# EAGLE design rc-winch-controller (EAGLE 5.12)
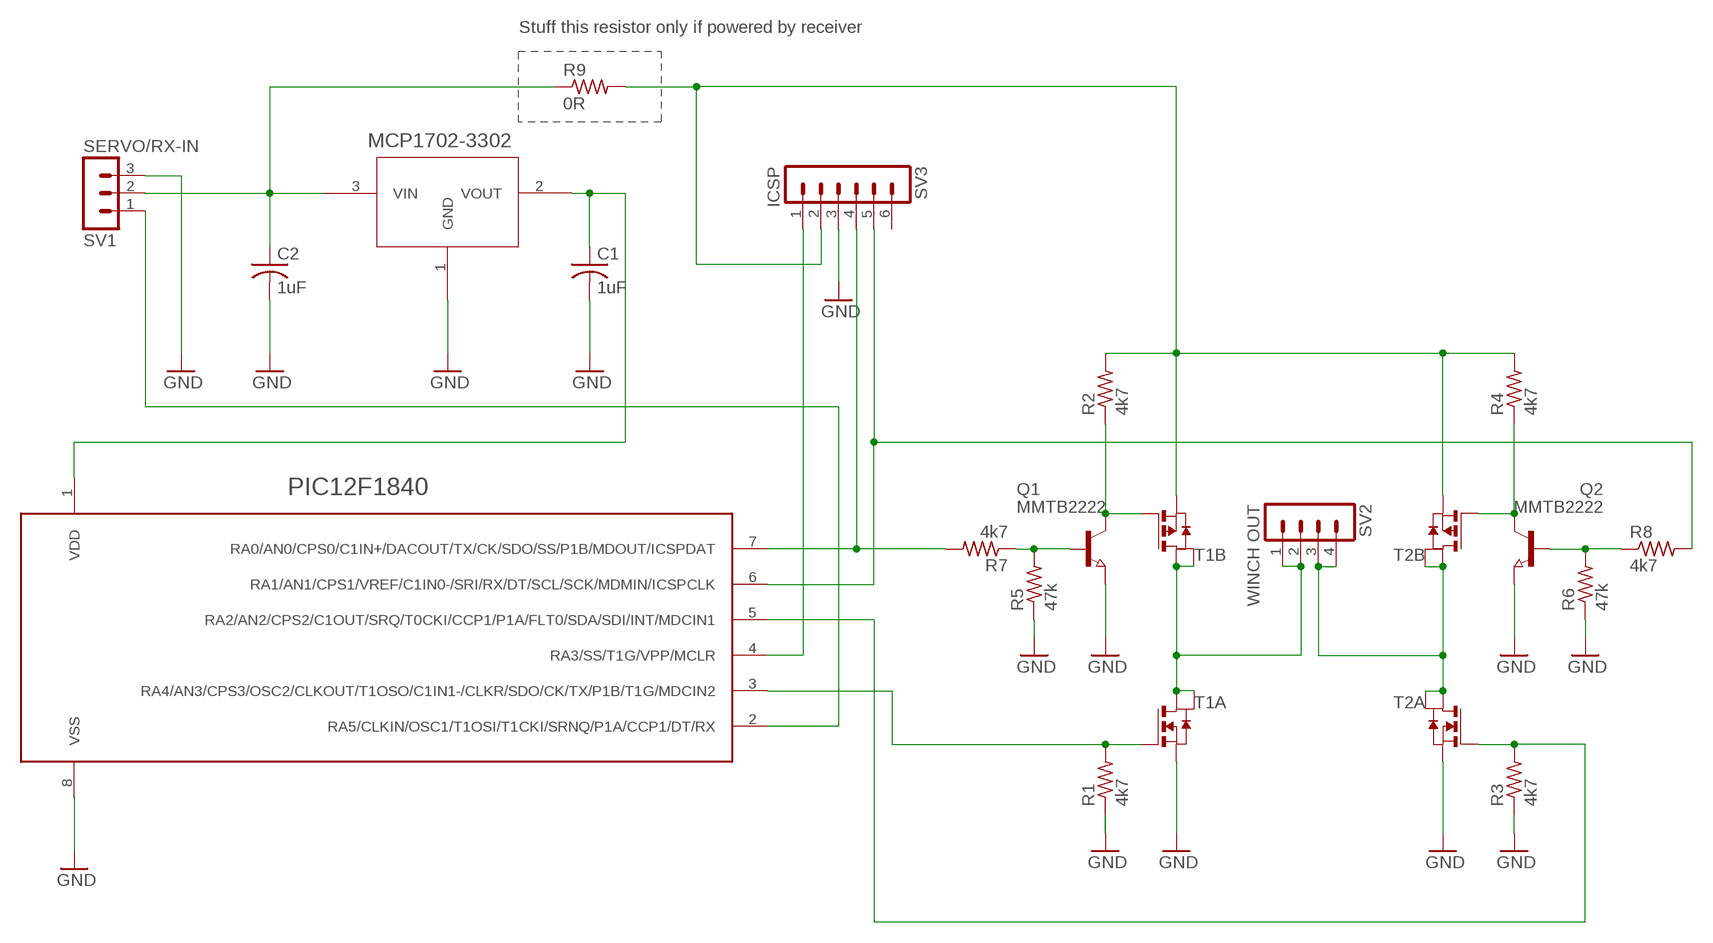
[diagram p0: schematic, sheet 1]

## Parts
C1  1uF  C-USC1206K  [C1206K]
C2  1uF  C-USC1206K  [C1206K]
Q1  MMTB2222  NPN-TRANSISTOR_SOT23  [SOT23]
Q2  MMTB2222  NPN-TRANSISTOR_SOT23  [SOT23]
R1  4k7  R-US_R0603  [R0603]
R2  4k7  R-US_R0603  [R0603]
R3  4k7  R-US_R0603  [R0603]
R4  4k7  R-US_R0603  [R0603]
R5  47k  R-US_R0603  [R0603]
R6  47k  R-US_R0603  [R0603]
R7  4k7  R-US_R0603  [R0603]
R8  4k7  R-US_R0603  [R0603]
R9  0R  R-US_R0603  [R0603]
SERVO/RX-IN  SV1  MA03-1  [MA03-1]
SV2  WINCH OUT  MA04-1  [MA04-1]
SV3  ICSP  MA06-1  [MA06-1]
T1  2x FDS9934  PN_MOSFET-SO8  [SO8]
T2  PN_MOSFET-SO8  [SO8]
U$1  MCP1702X-XXXXX/C  [SOT-23A_MC]
U$2  PIC12F1840  [SO8]

## Nets
3V3: C1.1 U$1.2(VOUT) U$2.1(VDD)
GND: C1.2 C2.2 Q1.2(E) Q2.2(E) R1.1 R3.1 R5.1 R6.1 SERVO/RX-IN.3 SV3.3 T1.1(A:S) T2.1(A:S) U$1.1(GND) U$2.8(VSS)
N$3: Q1.3(C) R2.1 T1.4(B:G)
N$4: R1.2 T1.2(A:G) U$2.3(RA4/AN3/CPS3/OSC2/CLKOUT/T1OSO/C1IN1-/CLKR/SDO/CK/TX/P1B/T1G/MDCIN2)
N$5: Q2.3(C) R4.1 T2.4(B:G)
N$6: R3.2 T2.2(A:G) U$2.5(RA2/AN2/CPS2/C1OUT/SRQ/T0CKI/CCP1/P1A/FLT0/SDA/SDI/INT/MDCIN1)
N$9: SERVO/RX-IN.1 U$2.2(RA5/CLKIN/OSC1/T1OSI/T1CKI/SRNQ/P1A/CCP1/DT/RX)
N$10: Q1.1(B) R5.2 R7.1
N$11: Q2.1(B) R6.2 R8.1
N$12: R7.2 SV3.4 U$2.7(RA0/AN0/CPS0/C1IN+/DACOUT/TX/CK/SDO/SS/P1B/MDOUT/ICSPDAT)
N$13: R8.2 SV3.5 U$2.6(RA1/AN1/CPS1/VREF/C1IN0-/SRI/RX/DT/SCL/SCK/MDMIN/ICSPCLK)
N$14: SV3.1 U$2.4(RA3/SS/T1G/VPP/MCLR)
OUT1: SV2.1 SV2.2 T1.5(B:D) T1.6(A:D2) T1.7(A:D) T1.8(B:D2)
OUT2: SV2.3 SV2.4 T2.5(B:D) T2.6(A:D2) T2.7(A:D) T2.8(B:D2)
VMOTOR: R2.2 R4.2 R9.2 SV3.2 T1.3(B:S) T2.3(B:S)
VRECEIVER: C2.1 R9.1 SERVO/RX-IN.2 U$1.3(VIN)
Unconnected: SV3.6

## Notes on the sheet
- Stuff this resistor only if powered by receiver

## Library data of the parts
C1 C2 = rcl:C-US: CAPACITOR, American symbol
Q1 Q2 = semicon-smd-ipc:NPN-TRANSISTOR_: NPN TRANSISTOR
R1-R9 = rcl:R-US_: RESISTOR, American symbol
SERVO/RX-IN = con-lstb:MA03-1: PIN HEADER; OC_FARNELL: unknown; OC_NEWARK: unknown
SV2 = con-lstb:MA04-1: PIN HEADER; OC_FARNELL: unknown; OC_NEWARK: unknown
SV3 = con-lstb:MA06-1: PIN HEADER; OC_FARNELL: unknown; OC_NEWARK: unknown
T1 T2 = Fairchild FDS9934C:PN_MOSFET-: DUAL N AND P-CHANNEL ENHANCEMENT MODE MOSFET source ZXMD63C02.pdf from http://www.zetex.com/; OC_FARNELL: unknown; OC_NEWARK: unknown
U$1 = MCP1702:MCP1702X-XXXXX/C
U$2 = PIC12F1840:PIC12F1840: Microchip PIC12F1840

## Board
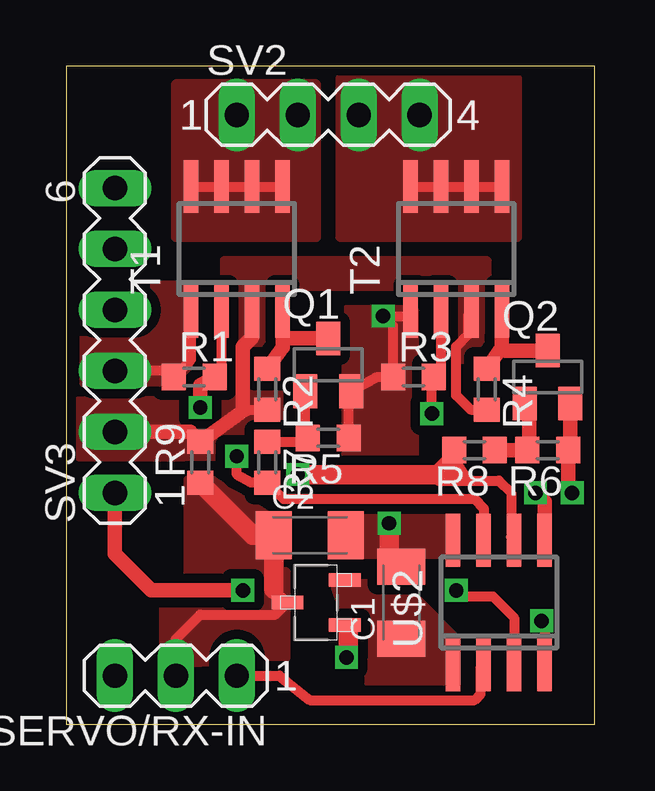
[diagram p1: board, top side]
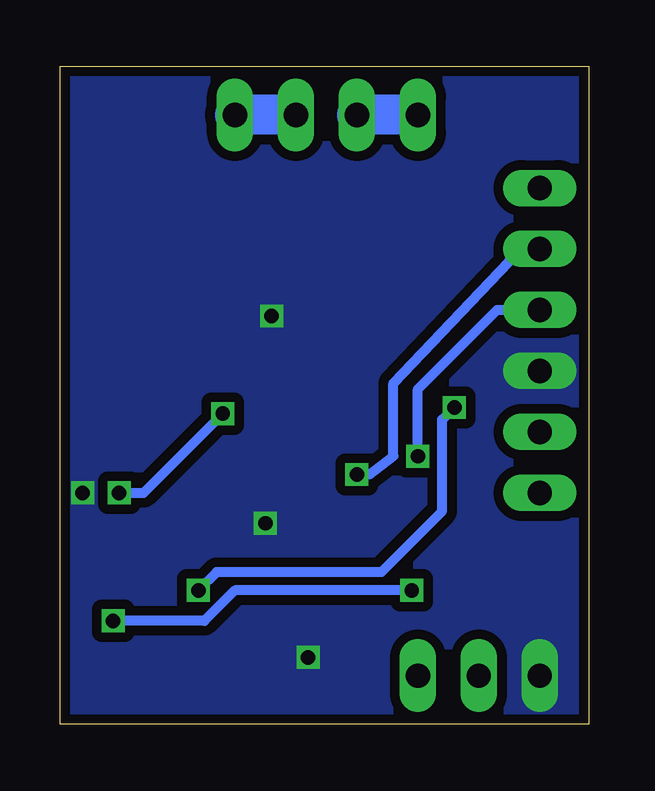
[diagram p2: board, bottom side, seen from below]

Size 22.02 x 27.42 mm. Coordinates in mm from the lower left corner, seen from the top.
Outline: 0,0 22.02,0 22.02,27.42 0,27.42 0,0
Copper layers (1*16): Top 0.0356mm / dielectric 1.5011mm / Bottom 0.0356mm
Design rules "LaenPCBOrder (OSH Park)": minimum track width 6mil, minimum drill 13mil, track to track 6mil, track to pad 6mil, pad to pad 6mil, via to via 6mil, smd to smd 6mil, copper to edge 15mil, drill to drill 6mil, minimum pad ring 7mil, minimum via ring 7mil, stop-mask expansion 4mil, vias tented up to drill 0mil, thermal gap 10mil

### Footprints (pad centres in the part's own frame; a part is rotated, then mirrored left to right if it is on the bottom)
C1206K = smd 1.5 x 2: 1 -1.5,0; 2 1.5,0
SOT23 = smd 1 x 1.4: 1 -0.95,-1.1; 2 0.95,-1.1; 3 0,1.1
R0603 = smd 1 x 1.1: 1 -0.85,0; 2 0.85,0
MA03-1 = drill 1.016 long: 1 -2.54,0; 2 0,0; 3 2.54,0
MA04-1 = drill 1.016 long: 1 -3.81,0; 2 -1.27,0; 3 1.27,0; 4 3.81,0
MA06-1 = drill 1.016 long: 1 -6.35,0; 2 -3.81,0; 3 -1.27,0; 4 1.27,0; 5 3.81,0; 6 6.35,0
SO8 = smd 0.6 x 2.2: 1 -1.905,-2.6; 2 -0.635,-2.6; 3 0.635,-2.6; 4 1.905,-2.6; 5 1.905,2.6; 6 0.635,2.6; 7 -0.635,2.6; 8 -1.905,2.6
SOT-23A_MC = smd 0.559 x 1.321: 1 -0.94,-1.194; 2 0.94,-1.194; 3 0,1.194

### Placement (x,y rotation side)
C1  13.97,5.08 90 top
C2  10.16,7.87 0 top
Q1  10.92,14.99 0 top
Q2  20.07,14.48 0 top
R1  5.33,14.48 0 top
R2  8.38,13.97 270 top
R3  14.48,14.48 0 top
R4  17.53,13.97 270 top
R5  10.92,11.94 180 top
R6  20.07,11.43 180 top
R7  8.38,10.92 270 top
R8  17.02,11.43 180 top
R9  5.59,10.92 90 top
SERVO/RX-IN  4.57,2.03 180 top
SV2  10.92,25.4 0 top
SV3  2.03,16 90 top
T1  7.11,19.81 0 top
T2  16.26,19.81 0 top
U$1  10.41,5.08 90 top
U$2  18.03,5.08 0 top

### Tracks (layer width: path | path; a pad name or v marks a point on that pad's centre or on a via)
3V3
  pour Top (isolate 0.406, no thermals): 11.18,5.84 12.7,1.52 16.26,1.52 16.26,3.56 14.48,5.33 14.48,5.84
GND  (via drill 0.6)
  Top 0.406: T2.1 14.16,17.02 v13.21,17.02 13.63,16.6 R3.1 12.97,14.48 Q1.2 11.77,13.89 R5.1 | R6.1 21.02,11.28 | 20.92,9.82 v21.08,9.65 | U$1.1 11.76,3.89 | 13.46,6.58 13.21,6.33 | 11.76,2.87 v11.68,2.79 | SV3.3 4.23,14.73 R1.1 5.21,15.2 T1.1
  Top 0.61: 21.02,11.28 Q2.2 | R6.1 20.92,9.82
  Top 0.813: 13.46,6.58 v13.46,8.38 | 11.76,3.89 11.76,2.87
  pour Bottom (isolate 0.406, no thermals): -15.75,29.72 24.89,29.72 24.89,-5.59 -15.75,-5.59
  pour Top (isolate 0.406, no thermals): 11.68,17.27 14.48,17.27 14.48,11.18 11.68,11.18
  pour Top (isolate 0.406, no thermals): 11.94,8.64 11.94,7.11 16,7.11 16,8.64
  pour Top (isolate 0.406, rank 2, no thermals): 5.08,18.29 0.76,18.29 0.76,14.22 5.08,14.22
N$3
  Top 0.406: 9.02,16 9.19,16.09
  Top 0.61: T1.4 9.02,16 9.02,15.71 R2.1 | 9.19,16.09 Q1.3
N$4  (via drill 0.6)
  Top 0.406: T1.2 6.48,14.77 R1.2 | U$2.3 18.67,4.45 17.78,5.33 16.51,5.33 v16.26,5.59
  Top 0.61: v5.59,13.21 5.59,14.14 R1.2
  Bottom 0.406: v16.26,5.59 15.49,6.35 8.64,6.35 6.1,8.89 6.1,12.7 v5.59,13.21
N$5
  Top 0.406: 18.16,16.26 T2.4 | 18.16,15.71 18.29,15.58
  Top 0.61: 18.16,16.26 18.16,15.71 R4.1 | 18.29,15.58 Q2.3
N$6  (via drill 0.6)
  Top 0.406: T2.2 15.62,14.77 R3.2 15.24,14.39 v15.24,12.95 | 19.94,9.27 v19.56,9.65
  Top 0.61: U$2.5 19.94,9.27
  Bottom 0.406: v19.56,9.65 18.54,9.65 v15.24,12.95
N$9
  Top 0.406: SERVO/RX-IN.1 8.89,2.03 10.16,1.02 17.02,1.02 17.27,1.27 17.27,2.35 U$2.2
N$10
  Top 0.406: R7.1 10.07,11.77 R5.2 9.97,11.94 Q1.1
N$11
  Top 0.406: Q2.1 19.12,13.14 19.3,12.95 | R6.2 19.3,11.26
  Top 0.61: 19.3,11.26 19.3,12.95 | R8.1 R6.2
N$12  (via drill 0.6)
  Top 0.406: U$2.7 17.4,9.02 17.02,9.4 9.06,9.4 R7.2 7.71,10.07 7.11,10.41 v7.11,11.18
  Bottom 0.406: v7.11,11.18 7.11,13.97 3.81,17.27 SV3.4
N$13  (via drill 0.6)
  Top 0.406: 16,10.92 R8.2 | U$2.6 18.54,7.81 18.54,9.65 18.03,10.16 16.76,10.16 | v9.65,10.41 10.16,10.41 | 16.76,10.16 15.49,10.16 15.24,10.41 | 16.76,10.16 16.26,10.92 | 15.49,10.41 16.51,10.41
  Top 0.813: 16,10.92 15.49,10.41 15.24,10.41 10.16,10.41
  Bottom 0.406: SV3.5 3.05,19.81 3.3,19.3 8.13,14.22 8.13,11.18 9.14,10.41 v9.65,10.41
N$14  (via drill 0.6)
  Top 0.406: v19.81,4.32 19.94,4.19 U$2.4
  Top 0.61: SV3.1 2.03,7.11 3.56,5.59 v7.37,5.59
  Bottom 0.406: v7.37,5.59 14.73,5.59 16,4.32 v19.81,4.32
OUT1
  Top 0.406: T1.8 T1.7 T1.6 T1.5
  Bottom 1.676: 7.37,25.4 SV2.2
  pour Top (no thermals): 4.57,20.32 10.41,20.32 10.41,26.67 4.57,26.67
OUT2
  Top 0.406: T2.5 T2.6 T2.7 T2.8
  Bottom 1.676: 12.45,25.4 SV2.4
  pour Top (no thermals): 11.43,26.92 11.43,20.32 18.8,20.32 18.8,26.92
VMOTOR
  Top 0.406: R4.2 16.85,13.12 16.26,13.72 16.26,15.75 16.76,16.26 16.76,17.09 T2.3 | R2.2 7.44,13.12 7.37,13.2 | R9.2 5.17,12.19 | 7.75,16.13 T1.3
  Top 0.61: R9.2 7.44,13.12 | 5.17,12.19 SV3.2 | 7.75,16.13 7.37,15.75 7.37,13.2
  pour Top (isolate 0.406, no thermals): 0.51,13.46 0.51,11.18 8.89,11.18 8.89,18.29 16,18.29 16,15.24 17.53,15.24 17.53,19.3 6.6,19.3 6.6,13.46
VRECEIVER
  Top 0.406: 8.66,5.64 U$1.3 8.71,4.57 5.59,4.57 4.57,3.56 SERVO/RX-IN.2
  Top 0.813: 8.66,5.64 C2.1 7.79,7.87 R9.1
  pour Top (isolate 0.406, no thermals): 5.08,10.16 5.08,6.1 8.89,6.1 8.89,8.38 6.1,10.16
  pour Top (isolate 0.406, no thermals): 4.06,6.35 4.06,2.54 9.14,2.79 9.14,6.35

### Text on the board
tValues: WINCH | OUT | * | * | 2N2222 | - | 2N2222 | + | - | + | S | MCP1702 | *
bValues: LANE Boys RC | Winch controller | CLK | Rev 1 | DAT | GND | Vcc | Vpp | - | + | S